# Altium schematic sheet SDRAM.SchDoc
size A4
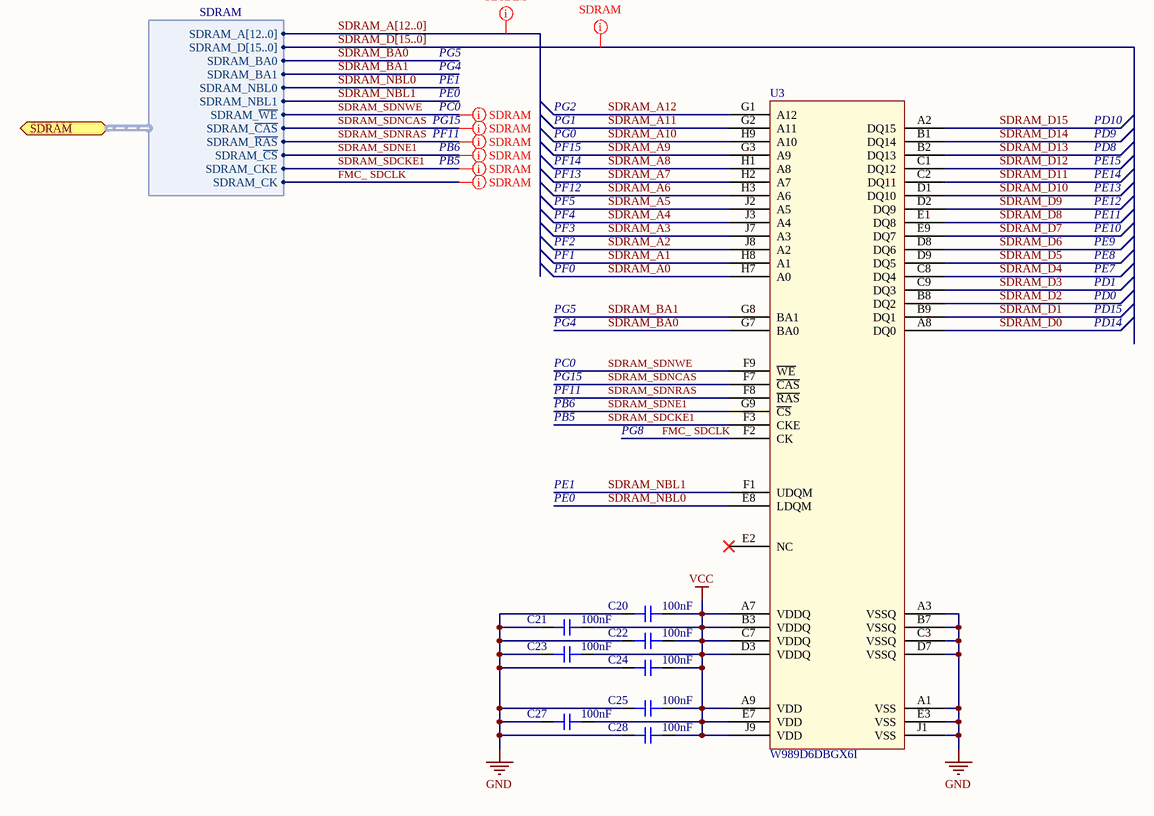
[diagram p0: SDRAM.SchDoc]

## Parts
C20  value 100nF  [Capacitor-0603]  (hidden comment: C-100nF-0603)
C21  value 100nF  [Capacitor-0603]  (hidden comment: C-100nF-0603)
C22  value 100nF  [Capacitor-0603]  (hidden comment: C-100nF-0603)
C23  value 100nF  [Capacitor-0603]  (hidden comment: C-100nF-0603)
C24  value 100nF  [Capacitor-0603]  (hidden comment: C-100nF-0603)
C25  value 100nF  [Capacitor-0603]  (hidden comment: C-100nF-0603)
C27  value 100nF  [Capacitor-0603]  (hidden comment: C-100nF-0603)
C28  value 100nF  [Capacitor-0603]  (hidden comment: C-100nF-0603)
U3  W989D6DBGX6I  [W989D6DBGX6I]

## Ports
SDRAM (bidir, harness SDRAM)

## Harnesses
SDRAM: SDRAM_A[12..0], SDRAM_D[15..0], SDRAM_BA0, SDRAM_BA1, SDRAM_NBL0, SDRAM_NBL1, SDRAM_~{WE}, SDRAM_~{CAS}, SDRAM_~{RAS}, SDRAM_~{CS}, SDRAM_CKE, SDRAM_CK

## Nets
GND: C20.1 C21.1 C22.1 C23.1 C24.1 C25.1 C27.1 C28.1 U3.A1(VSS) U3.A3(VSSQ) U3.B7(VSSQ) U3.C3(VSSQ) U3.D7(VSSQ) U3.E3(VSS) U3.J1(VSS)
VCC: C20.2 C21.2 C22.2 C23.2 C24.2 C25.2 C27.2 C28.2 U3.A7(VDDQ) U3.A9(VDD) U3.B3(VDDQ) U3.C7(VDDQ) U3.D3(VDDQ) U3.E7(VDD) U3.J9(VDD)
FMC_ SDCLK: U3.F2(CK) ; port SDRAM.SDRAM_CK
SDRAM_A0: U3.H7(A0)
SDRAM_A1: U3.H8(A1)
SDRAM_A2: U3.J8(A2)
SDRAM_A3: U3.J7(A3)
SDRAM_A4: U3.J3(A4)
SDRAM_A5: U3.J2(A5)
SDRAM_A6: U3.H3(A6)
SDRAM_A7: U3.H2(A7)
SDRAM_A8: U3.H1(A8)
SDRAM_A9: U3.G3(A9)
SDRAM_A10: U3.H9(A10)
SDRAM_A11: U3.G2(A11)
SDRAM_A12: U3.G1(A12)
SDRAM_BA0: U3.G7(BA0) ; port SDRAM.SDRAM_BA0
SDRAM_BA1: U3.G8(BA1) ; port SDRAM.SDRAM_BA1
SDRAM_D0: U3.A8(DQ0)
SDRAM_D1: U3.B9(DQ1)
SDRAM_D2: U3.B8(DQ2)
SDRAM_D3: U3.C9(DQ3)
SDRAM_D4: U3.C8(DQ4)
SDRAM_D5: U3.D9(DQ5)
SDRAM_D6: U3.D8(DQ6)
SDRAM_D7: U3.E9(DQ7)
SDRAM_D8: U3.E1(DQ8)
SDRAM_D9: U3.D2(DQ9)
SDRAM_D10: U3.D1(DQ10)
SDRAM_D11: U3.C2(DQ11)
SDRAM_D12: U3.C1(DQ12)
SDRAM_D13: U3.B2(DQ13)
SDRAM_D14: U3.B1(DQ14)
SDRAM_D15: U3.A2(DQ15)
SDRAM_NBL0: U3.E8(LDQM) ; port SDRAM.SDRAM_NBL0
SDRAM_NBL1: U3.F1(UDQM) ; port SDRAM.SDRAM_NBL1
SDRAM_SDCKE1: U3.F3(CKE) ; port SDRAM.SDRAM_CKE
SDRAM_SDNCAS: U3.F7(~{CAS}) ; port SDRAM.SDRAM_~{CAS}
SDRAM_SDNE1: U3.G9(~{CS}) ; port SDRAM.SDRAM_~{CS}
SDRAM_SDNRAS: U3.F8(~{RAS}) ; port SDRAM.SDRAM_~{RAS}
SDRAM_SDNWE: U3.F9(~{WE}) ; port SDRAM.SDRAM_~{WE}

Not connected (* = marked no-connect by the designer): U3 E2(NC)*

## Buses and harness runs
bus SDRAM_A[12..0]
bus SDRAM_D[15..0]

## Layout directives
mark named SDRAM: (no net found under the mark), FMC_ SDCLK, SDRAM_SDCKE1, SDRAM_SDNCAS, SDRAM_SDNE1, SDRAM_SDNRAS, SDRAM_SDNWE

## Notes on the sheet
- PG5
- PG4
- PC0
- PE1
- PE0
- PG2
- PG15
- PF11
- PB6
- PB5
- PG1
- PG0
- PF15
- PF14
- PF13
- PF12
- PD10
- PD9
- PD8
- PE15
- PE14
- PE13
- PF5
- PF4
- PF3
- PF2
- PE12
- PE11
- PE10
- PE9
- PF1
- PF0
- PE8
- PE7
- PD1
- PD0
- PD15
- PD14
- PG8

## Library data of the parts
C20-C25 C27 C28 = C-100nF-0603: Supplier 1: Digi-Key; Supplier Part Number 1: 1276-1006-1-ND
U3 = W989D6DBGX6I: Supplier 1: Digi-Key; Supplier Part Number 1: W989D6DBGX6ITR-ND